# Altium schematic sheet stmschematic.SchDoc
size A; SheetNumber: 7; SheetTotal: 8
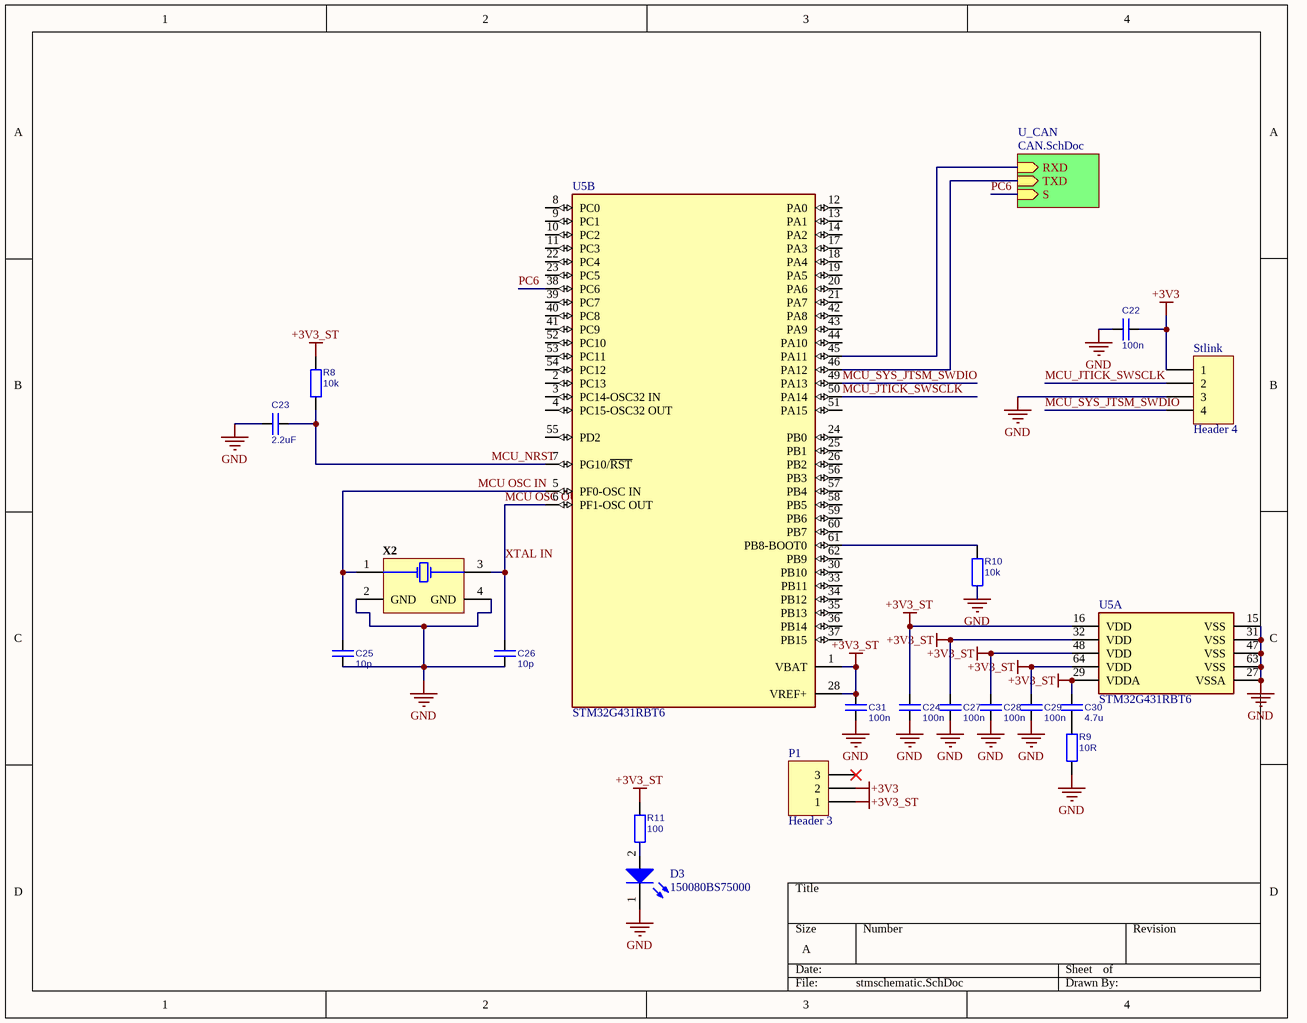
[diagram p0: stmschematic.SchDoc]

## Parts
C22  100n  [C0603]
C23  2.2uF  [C0603]
C24  100n  [C0603]
C25  10p  [C0603]
C26  10p  [C0603]
C27  100n  [C0603]
C28  100n  [C0603]
C29  100n  [C0603]
C30  4.7u  [C0603]
C31  100n  [C0603]
D3  150080BS75000  [WL-SMCW_0805_150080xx75000]
P1  Header 3  [HDR1X3]
R8  10k  [R0603]
R9  10R  [R0603]
R10  10k  [R0603]
R11  100  [R0603]
Stlink  Header 4  [HDR1X4]
U5  STM32G431RBT6  [FP-LQFP64-5W-MFG]  (parts A,B of 2)
X2  TSX-3225 24.0000MF15X-AC3  [EPSON-TSX-3225_V]  (value not drawn)

## Sub-sheets
U_CAN = CAN.SchDoc: RXD (in), TXD (in), S (in)

## Nets
+3V3: C22.2 P1.2 Stlink.1
+3V3_ST: C24.1 C27.1 C28.1 C29.1 C30.1 C31.1 P1.1 R8.1 R11.2 U5.1(VBAT) U5.16(VDD) U5.28(VREF+) U5.29(VDDA) U5.32(VDD) U5.48(VDD) U5.64(VDD)
GND: C22.1 C23.1 C24.2 C25.2 C26.2 C27.2 C28.2 C29.2 C31.2 D3.1(K) R9.2 R10.2 Stlink.3 U5.15(VSS) U5.27(VSSA) U5.31(VSS) U5.47(VSS) U5.63(VSS) X2.2(GND) X2.4(GND)
MCU OSC IN: C25.1 U5.5(PF0-OSC_IN) X2.1(X1)
MCU OSC OUT: C26.1 U5.6(PF1-OSC_OUT) X2.3(X2)  [also labelled XTAL IN]
MCU_JTICK_SWSCLK: Stlink.2 U5.50(PA14)
MCU_NRST: C23.2 R8.2 U5.7(PG10/~{RST})
MCU_SYS_JTSM_SWDIO: Stlink.4 U5.49(PA13)
PC6: U5.38(PC6) ; sheet U_CAN/S
NetC30_2: C30.2 R9.1
NetD3_2: D3.2(A) R11.1
NetR10_1: R10.1 U5.61(PB8-BOOT0)
NetU5_45: U5.45(PA11) ; sheet U_CAN/RXD
NetU5_46: U5.46(PA12) ; sheet U_CAN/TXD

Not connected (* = marked no-connect by the designer): P1 3*; U5 2(PC13) 3(PC14-OSC32_IN) 4(PC15-OSC32_OUT) 8(PC0) 9(PC1) 10(PC2) 11(PC3) 12(PA0) 13(PA1) 14(PA2) 17(PA3) 18(PA4) 19(PA5) 20(PA6) 21(PA7) 22(PC4) 23(PC5) 24(PB0) 25(PB1) 26(PB2) 30(PB10) 33(PB11) 34(PB12) 35(PB13) 36(PB14) 37(PB15) 39(PC7) 40(PC8) 41(PC9) 42(PA8) 43(PA9) 44(PA10) 51(PA15) 52(PC10) 53(PC11) 54(PC12) 55(PD2) 56(PB3) 57(PB4) 58(PB5) 59(PB6) 60(PB7) 62(PB9)

## Library data of the parts
C22-C31 = C: Capacitor
  C22 C24 C27-C29 C31: Value: 100n
  C23: Value: 2.2uF
  C25 C26: Value: 10p
  C30: Value: 4.7u
D3 = CMP-1426-00008-6: NexarPartId: 29717779; Test Current: 20mA; Lens Style: Clear, Rectangular; Forward Current: 100mA; Power Dissipation: 105mW; Dominant Wavelength: 470nm; Reverse Voltage: 5V; Viewing Angle: 140°; Luminous Intensity: 145mcd; Color: Blue; Forward Voltage: 3.2V; Max Junction Temperature (Tj): 95°C; Peak Wavelength: 465nm; Min Operating Temperature: -40°C; Mount: Surface Mount; Case Code (Imperial): 0805; Packaging: Tape and Reel; Lead Free: Lead Free; Length: 2mm; Case/Package: 0805; Case Code (Metric): 2012; Max Operating Temperature: 85°C; Height: 700µm; RoHS: Compliant; Max Reverse Voltage (DC): 5V; REACH SVHC: Unknown; Width: 1.25mm; Wavelength: 470nm
P1 = Header 3: Header, 3-Pin; LatestRevisionDate: 17-Jul-2002; LatestRevisionNote: Re-released for DXP Platform.; Publisher: Altium Limited
R8-R11 = R
  R8 R10: Value: 10k
  R9: Value: 10R
  R11: Value: 100
Stlink = Header 4: Header, 4-Pin; LatestRevisionDate: 17-Jul-2002; LatestRevisionNote: Re-released for DXP Platform.; Publisher: Altium Limited
U5 = CMP-12105-000150-1: IC MCU 32BIT 128KB FLASH 64LQFP; RoHS Compliant: Yes
X2 = CMP-2000-07333-1: MHz Range Crystal, 24 MHz, -40 to 85 degC, 4-Pin SMD, RoHS, Tape and Reel; Manufacturer: Epson; Brand: EpsonTiming; Frequency Stability: 10PPM; Frequency: 24MHz; ESR: 40Ohms; Load Capacitance: 9pF; Unit Weight: 0.000564oz; Drive Level: 200uW; Datasheet Version: 12/2015; RoHS: True; Operating Temperature Range: -40Cto+85C; Length: 3.2mm; Tolerance: 10PPM; Width: 2.5mm; Mounting Technology: SurfaceMount; Package Description: 4-Pin Surface Mount Device, Body 3.2 x 2.5 mm; Manufacturer URL: https://www.eea.epson.com/; Factory Pack Quantity: 250; Package Reference: TSX-3225; Height: 0.6mm; Mounting Style: SMD/SMT; Termination Style: SMD/SMT; Datasheet URL: https://support.epson.biz/td/api/doc_check.php?dl=brief_FA-238V_en.pdf; Type: Crystal; Series: TSX-3225; Package / Case: 3.2mmx2.5mm; Product Category: Crystals; Packaging: Reel